# Altium schematic sheet Smart_Switch.SchDoc
size A4
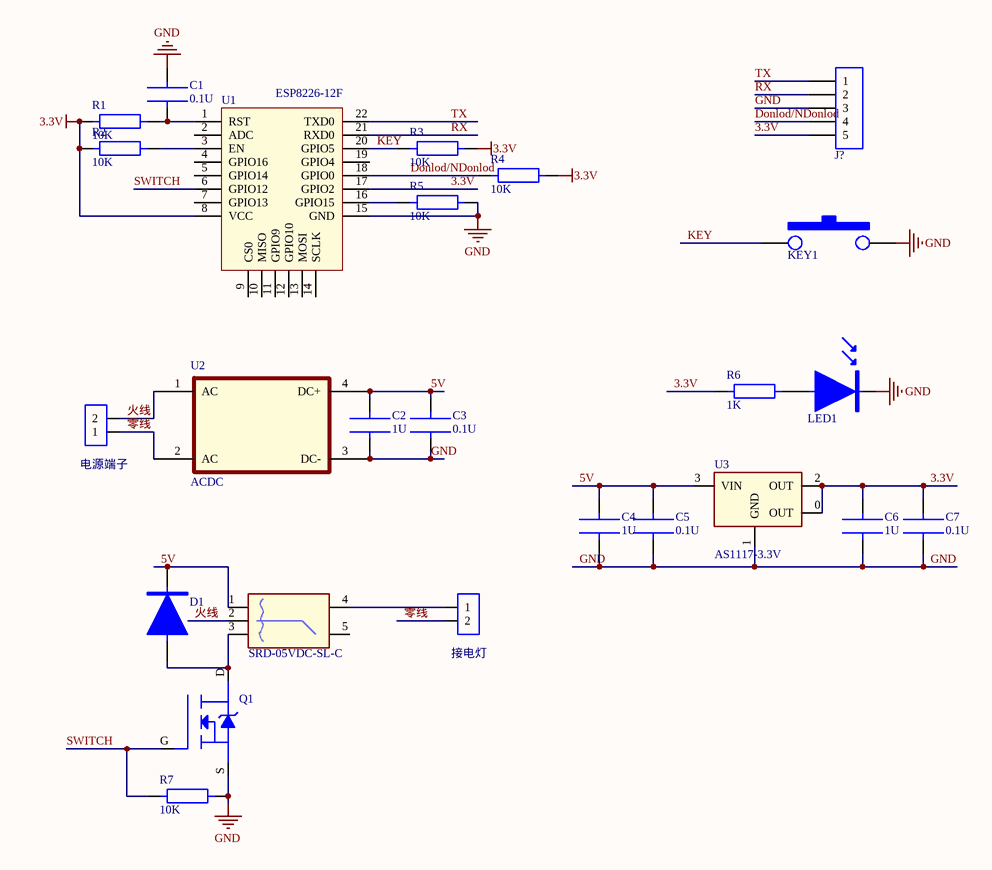
[diagram p0: Smart_Switch.SchDoc]

## Parts
C1  0.1U  [0603C]
C2  1U  [0805C]
C3  0.1U  [0603C]
C4  1U  [0805C]
C5  0.1U  [0805C]
C6  1U  [0805C]
C7  0.1U  [0805C]
D1  SOD  [1206D]  (value not drawn)
J?  5P  [SIP5]  (value not drawn)
KEY1  KEY  [KEY]  (value not drawn)
LED1  LED  [0603D]  (value not drawn)
Q1  NMOS  [SOT-23-D]  (value not drawn)
R1  10K  [0603R]
R2  10K  [0603R]
R3  10K  [0603R]
R4  10K  [0603R]
R5  10K  [0603R]
R6  1K  [0603R]
R7  10K  [0603R]
SRD-05VDC-SL-C  JIDIANQI  [JDQ_S]  (value not drawn)
U1  ESP8226-12F  [ESP8226-12F]
U2  ACDC
U3  AS1117-3.3V  [SOT-223]
接电灯  2P  [KF2EDG3.81_PWR]  (value not drawn)
电源端子  2P  [KF2EDG3.81_PWR]  (value not drawn)

## Nets
3.3V: C6.2 C7.2 J?.5 R1.2 R2.2 R3.1 R4.1 R6.2 U1.8(VCC) U1.17(GPIO2) U3.0(OUT) U3.2(OUT)
GND: C1.1 C2.1 C3.1 C4.1 C5.1 C6.1 C7.1 J?.3 KEY1.2 LED1.K Q1.S R5.1 R7.1 U1.15(GND) U2.3(DC-) U3.1(GND)
5V: C2.2 C3.2 C4.2 C5.2 D1.2 SRD-05VDC-SL-C.1 U2.4(DC+) U3.3(VIN)
Donlod/NDonlod: J?.4 R4.2 U1.18(GPIO0)
KEY: KEY1.1 R3.2 U1.20(GPIO5)
RX: J?.2 U1.21(RXD0)
SWITCH: Q1.G R7.2 U1.6(GPIO12)
TX: J?.1 U1.22(TXD0)
火线: SRD-05VDC-SL-C.2 U2.1(AC) 电源端子.2
零线: U2.2(AC) 接电灯.2 电源端子.1
NetC1_2: C1.2 R1.1 U1.1(RST)
NetD1_1: D1.1 Q1.D SRD-05VDC-SL-C.3
NetLED1_A: LED1.A R6.1
NetR2_1: R2.1 U1.3(EN)
NetR5_2: R5.2 U1.16(GPIO15)
NetSRD-05VDC-SL-C_4: SRD-05VDC-SL-C.4 接电灯.1

Not connected (* = marked no-connect by the designer): SRD-05VDC-SL-C 5; U1 2(ADC) 4(GPIO16) 5(GPIO14) 7(GPIO13) 9(CS0) 10(MISO) 11(GPIO9) 12(GPIO10) 13(MOSI) 14(SCLK) 19(GPIO4)

## Library data of the parts
C1-C7 = CAP1
R1-R7 = RES